# Altium schematic sheet PAGE2-SFP_CONNECTORS.SchDoc
size A3
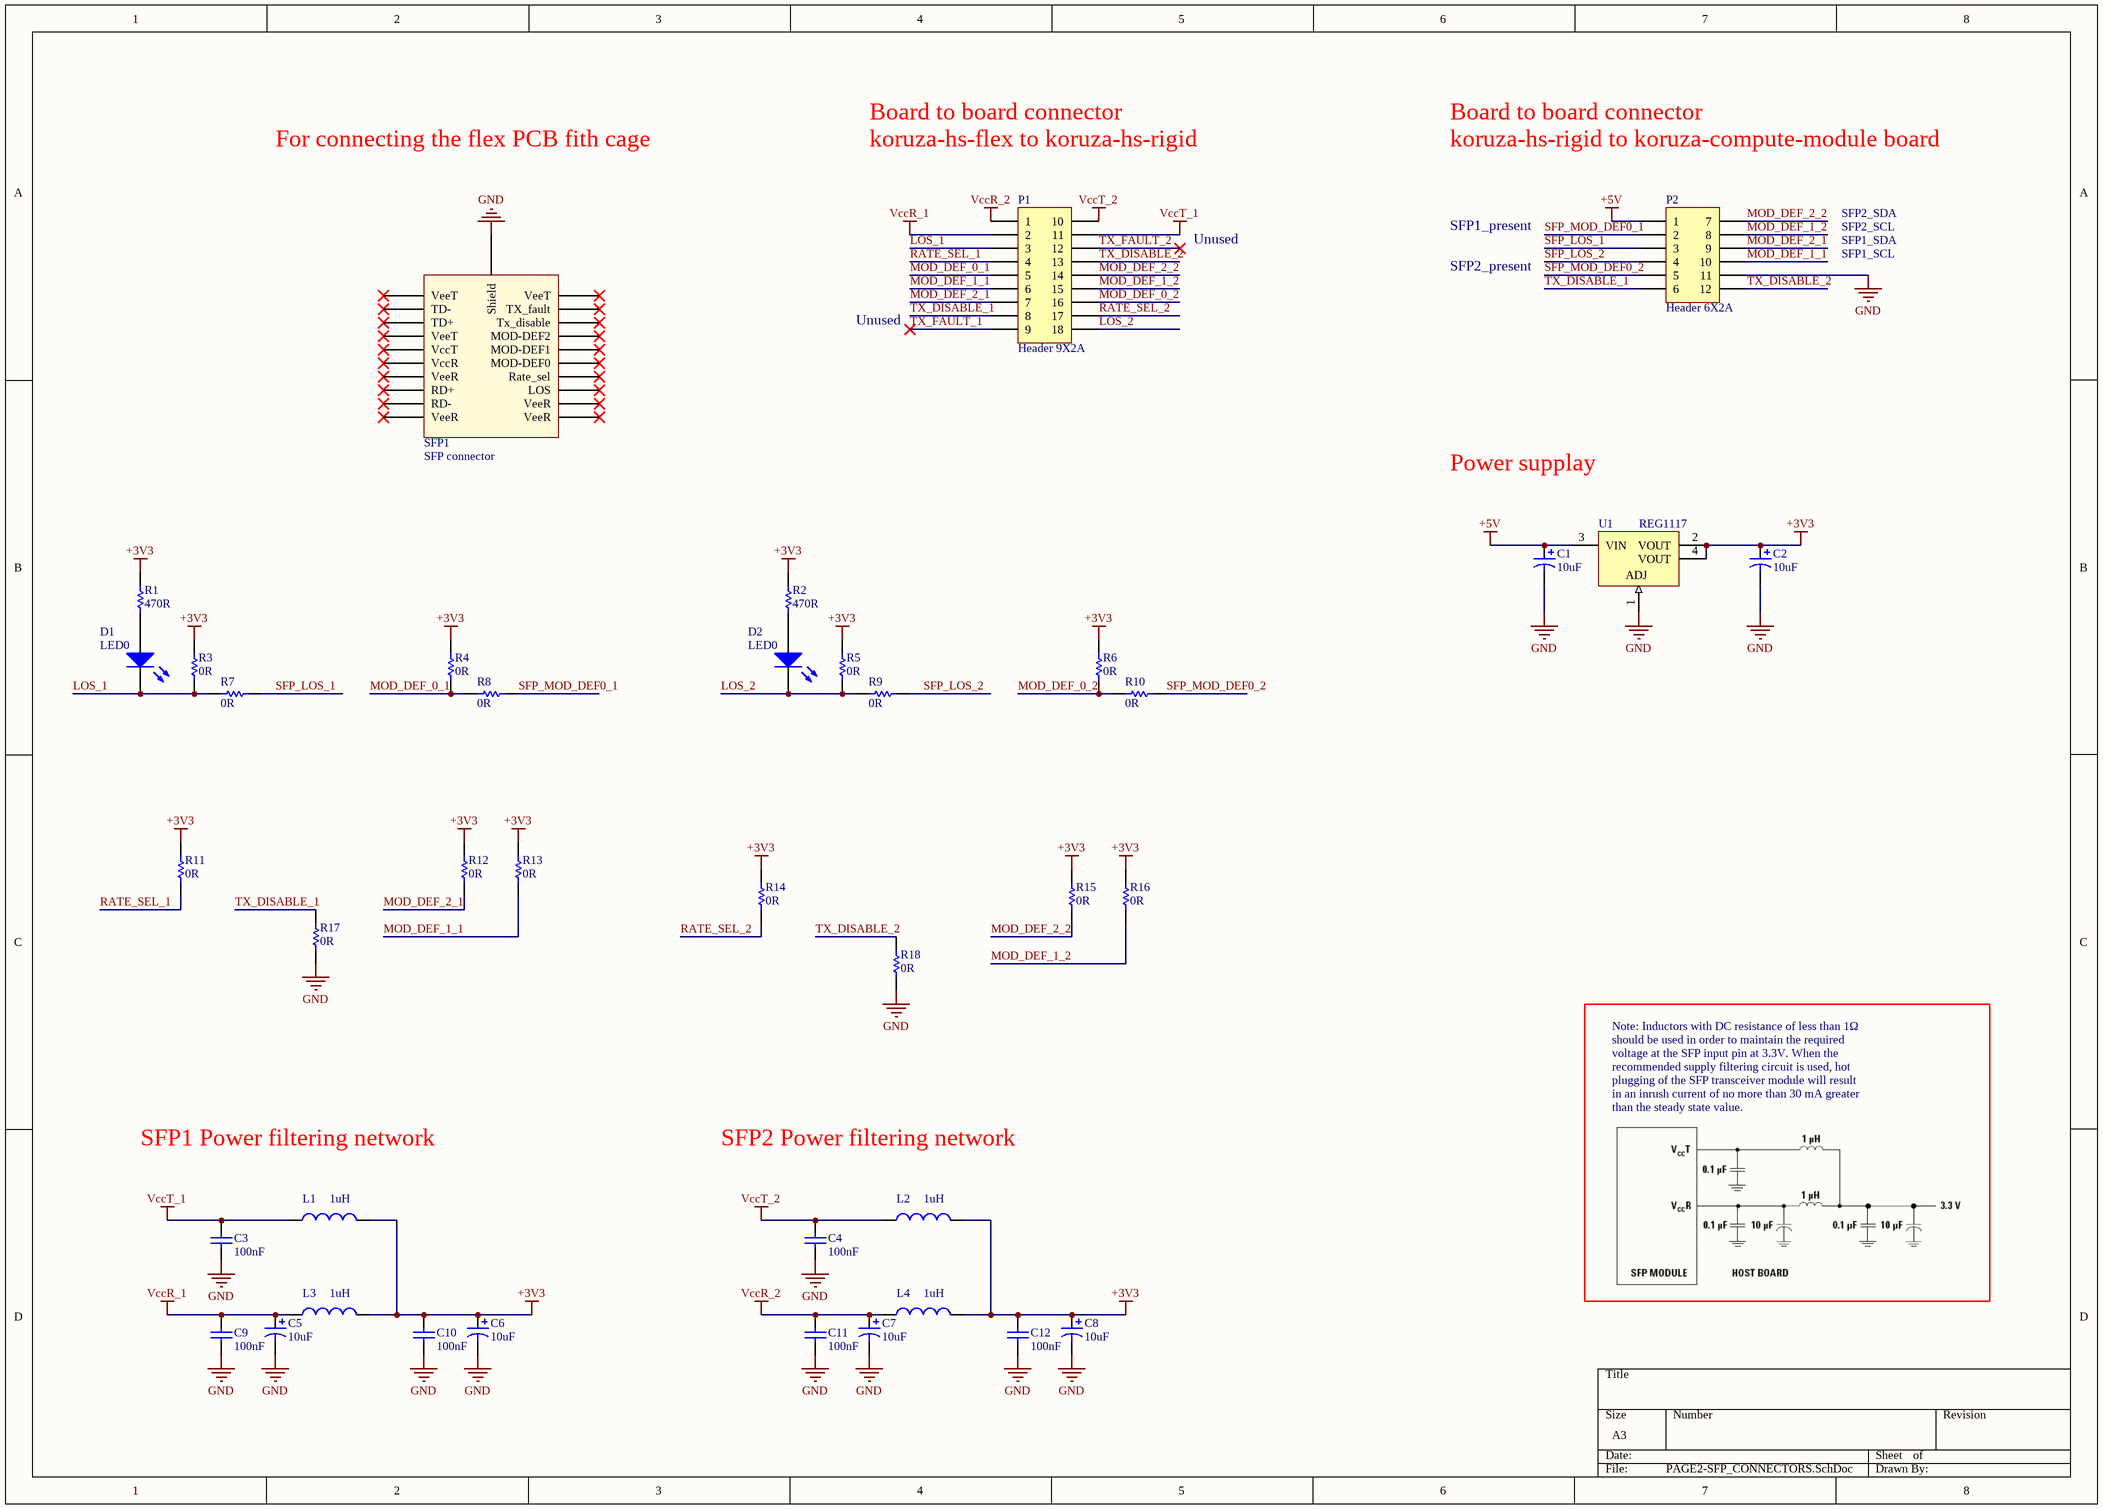
[diagram p0: PAGE2-SFP_CONNECTORS.SchDoc]

## Parts
C1  10uF  [CAP0805]
C2  10uF  [CAP0805]
C3  100nF  [CAP0603]
C4  100nF  [CAP0603]
C5  10uF  [CAP0805]
C6  10uF  [CAP0805]
C7  10uF  [CAP0805]
C8  10uF  [CAP0805]
C9  100nF  [CAP0603]
C10  100nF  [CAP0603]
C11  100nF  [CAP0603]
C12  100nF  [CAP0603]
D1  LED0  [DIODE0603]
D2  LED0  [DIODE0603]
L1  1uH  [6-0805_N]
L2  1uH  [6-0805_N]
L3  1uH  [6-0805_N]
L4  1uH  [6-0805_N]
P1  Header 9X2A  [HDR2X9_CEN]
P2  Header 6X2A  [HDR2X6_CEN]
R1  470R  [RES0603]
R2  470R  [RES0603]
R3  0R  [RES0603]
R4  0R  [RES0603]
R5  0R  [RES0603]
R6  0R  [RES0603]
R7  0R  [RES0603]
R8  0R  [RES0603]
R9  0R  [RES0603]
R10  0R  [RES0603]
R11  0R  [RES0603]
R12  0R  [RES0603]
R13  0R  [RES0603]
R14  0R  [RES0603]
R15  0R  [RES0603]
R16  0R  [RES0603]
R17  0R  [RES0603]
R18  0R  [RES0603]
SFP1  SFP connector  [PCB_SFP_COVER]
U1  REG1117  [TI-DCY4_N]

## Nets
+3V3: C2.1 C6.1 C8.1 C10.2 C12.2 L1.2 L2.2 L3.2 L4.2 R1.2 R2.2 R3.1 R4.1 R5.1 R6.1 R11.1 R12.1 R13.1 R14.1 R15.1 R16.1 U1.2(VOUT) U1.4(VOUT)
+5V: C1.1 P2.1 U1.3(VIN)
GND: C1.2 C2.2 C3.1 C4.1 C5.2 C6.2 C7.2 C8.2 C9.1 C10.1 C11.1 C12.1 P2.11 R17.2 R18.2 SFP1.21(Shield) U1.1(ADJ)
VccR_1: C5.1 C9.2 L3.1 P1.2
VccR_2: C7.1 C11.2 L4.1 P1.1
VccT_1: C3.2 L1.1 P1.11
VccT_2: C4.2 L2.1 P1.10
LOS_1: D1.2(K) P1.3 R3.2 R7.1
LOS_2: D2.2(K) P1.18 R5.2 R9.1
MOD_DEF_0_1: P1.5 R4.2 R8.1
MOD_DEF_0_2: P1.16 R6.2 R10.1
MOD_DEF_1_1: P1.6 P2.10 R13.2
MOD_DEF_1_2: P1.15 P2.8 R16.2
MOD_DEF_2_1: P1.7 P2.9 R12.2
MOD_DEF_2_2: P1.14 P2.7 R15.2
RATE_SEL_1: P1.4 R11.2
RATE_SEL_2: P1.17 R14.2
SFP_LOS_1: P2.3 R7.2
SFP_LOS_2: P2.4 R9.2
SFP_MOD_DEF0_1: P2.2 R8.2
SFP_MOD_DEF0_2: P2.5 R10.2
TX_DISABLE_1: P1.8 P2.6 R17.1
TX_DISABLE_2: P1.13 P2.12 R18.1
TX_FAULT_1: P1.9
TX_FAULT_2: P1.12
NetD1_1: D1.1(A) R1.1
NetD2_1: D2.1(A) R2.1

Not connected (* = marked no-connect by the designer): SFP1 1(VeeT)* 2(TX_fault)* 3(Tx_disable)* 4(MOD-DEF2)* 5(MOD-DEF1)* 6(MOD-DEF0)* 7(Rate_sel)* 8(LOS)* 9(VeeR)* 10(VeeR)* 11(VeeR)* 12(RD-)* 13(RD+)* 14(VeeR)* 15(VccR)* 16(VccT)* 17(VeeT)* 18(TD+)* 19(TD-)* 20(VeeT)*

## Notes on the sheet
- For connecting the flex PCB fith cage
- Board to board connector
- koruza-hs-flex to koruza-hs-rigid
- koruza-hs-rigid to koruza-compute-module board
- Unused
- SFP1_present
- SFP2_SDA
- SFP2_SCL
- SFP1_SDA
- SFP2_present
- SFP1_SCL
- Power supplay
- Note: Inductors with DC resistance of less than 1Ω
  should be used in order to maintain the required
  voltage at the SFP input pin at 3.3V. When the
  recommended supply filtering circuit is used, hot
  plugging of the SFP transceiver module will result
  in an inrush current of no more than 30 mA greater
  than the steady state value.
- SFP1 Power filtering network
- SFP2 Power filtering network

## Library data of the parts
C1 C2 C5-C8 = Cap Pol1: Polarized Capacitor (Radial); Published: 8-Jun-2000; LatestRevisionDate: 17-Jul-2002; LatestRevisionNote: Re-released for DXP Platform.; PackageReference: RB7.6-15; Publisher: Altium Limited; PackageDescription: Polarized Capacitor (Radial); 2 Leads; Value: 10uF
C3 C4 C9-C12 = Cap: Capacitor; Published: 8-Jun-2000; LatestRevisionDate: 17-Jul-2002; LatestRevisionNote: Re-released for DXP Platform.; PackageReference: RAD-0.3; Publisher: Altium Limited; PackageDescription: Radial Cap, Thru-Hole; 2 Leads; 0.3 in Pin Spacing; Value: 100nF
D1 D2 = LED0: Typical INFRARED GaAs LED; Published: 8-Jun-2000; LatestRevisionDate: 08-Jul-2005; LatestRevisionNote: Mech Layer 1 removed.; PackageReference: LED-0; Publisher: Altium Limited; PackageDescription: LED; 2 Leads
L1-L4 = Inductor: Code_IEC: 1005; Published: 8-Jun-2000; LatestRevisionDate: 29-May-2009; LatestRevisionNote: IPC-7351 Footprint Added.; PackageReference: 0402-A; Publisher: Altium Limited; PackageDescription: Chip Inductor; Code_JEITA: 0402; Value: 1uH
P1 = Header 9X2A: Header, 9-Pin, Dual row; LatestRevisionDate: 17-Jul-2002; LatestRevisionNote: Re-released for DXP Platform.; Publisher: Altium Limited
P2 = Header 6X2A: Header, 6-Pin, Dual row; LatestRevisionDate: 17-Jul-2002; LatestRevisionNote: Re-released for DXP Platform.; Publisher: Altium Limited
R1-R18 = Res1: Resistor; Published: 8-Jun-2000; LatestRevisionDate: 17-Jul-2002; LatestRevisionNote: Re-released for DXP Platform.; Publisher: Altium Limited; PackageDescription: Axial Device, Thru-Hole; 2 Leads; 0.3 in Pin Spacing
  R1 R2: PackageReference: RES0603; Value: 470R
  R3-R18: PackageReference: AXIAL-0.3; Value: 0R
U1 = REG1117: Single Output LDO, 800 mA, Adjustable 1.5 to 13.5 V Output, 3.8 to 15 V Input, with Internal Current Limiting, 4-pin SOT-223 (DCY), -40 to 125 degC, Green (RoHS & no Sb/Br); Manufacturer: Texas Instruments; Iout(Max)(A): 0.8; Iq(Typ)(mA): 4; Rating: Catalog; SubFamily: Single Channel LDO; Vdo(Typ)(mV): 1100; Vin(Max)(V): 15; Vin(Min)(V): 3.8; Vout Adj(Max)(V): 13.5; Vout Adj(Min)(V): 1.25; DatasheetVersion: SBVS001D; PackageVersion: 4202506/B; PackageReference: DCY4; PackageDescription: 4-Pin Plastic Small Outline, Body 3.5 x 6.5 mm, Pitch 2.3 mm; Supplier 1: Digi-Key; Supplier Part Number 1: REG1117-ND; Supplier 2: Farnell; Supplier Part Number 2: 1097566; Supplier 3: Newark; Supplier Part Number 3: 14P6981; Supplier 4: Mouser; Supplier Part Number 4: 595-REG1117; Eco-Plan: Green (RoHS & no Sb/Br); Mounting Technology: Surface Mount; Code_JEDEC: TO-261; PartNumber: REG1117; ComponentLink1Description: Manufacturer URL; ComponentLink1URL: http://www.ti.com/; ComponentLink2Description: Datasheet; ComponentLink2URL: http://www.ti.com/general/docs/lit/getliterature.tsp?genericPartNumber=REG1117&fileType=pdf; ComponentLink3Description: Package Specification; ComponentLink3URL: http://www.ti.com/litv/pdf/mpds094a